# EAGLE board Precision Arduino Charlieplex (EAGLE 6.2), part 1 of 2
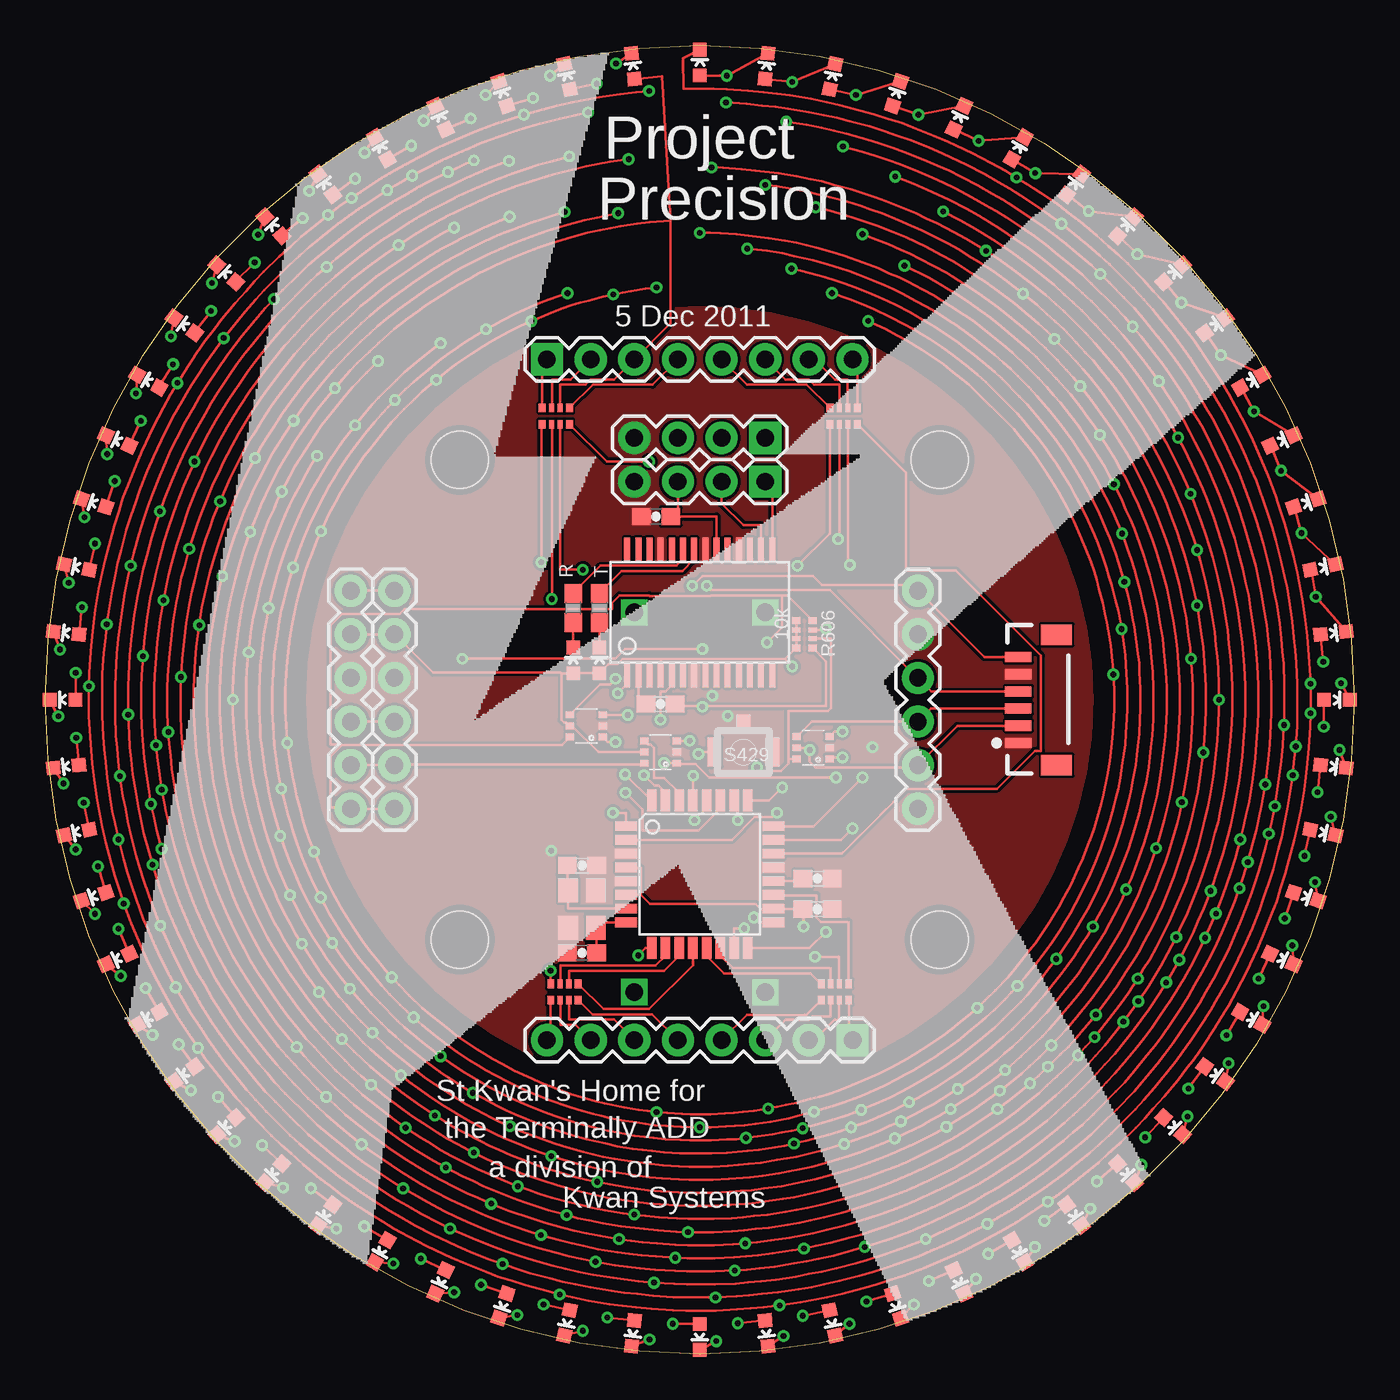
[diagram p2: board, top side]
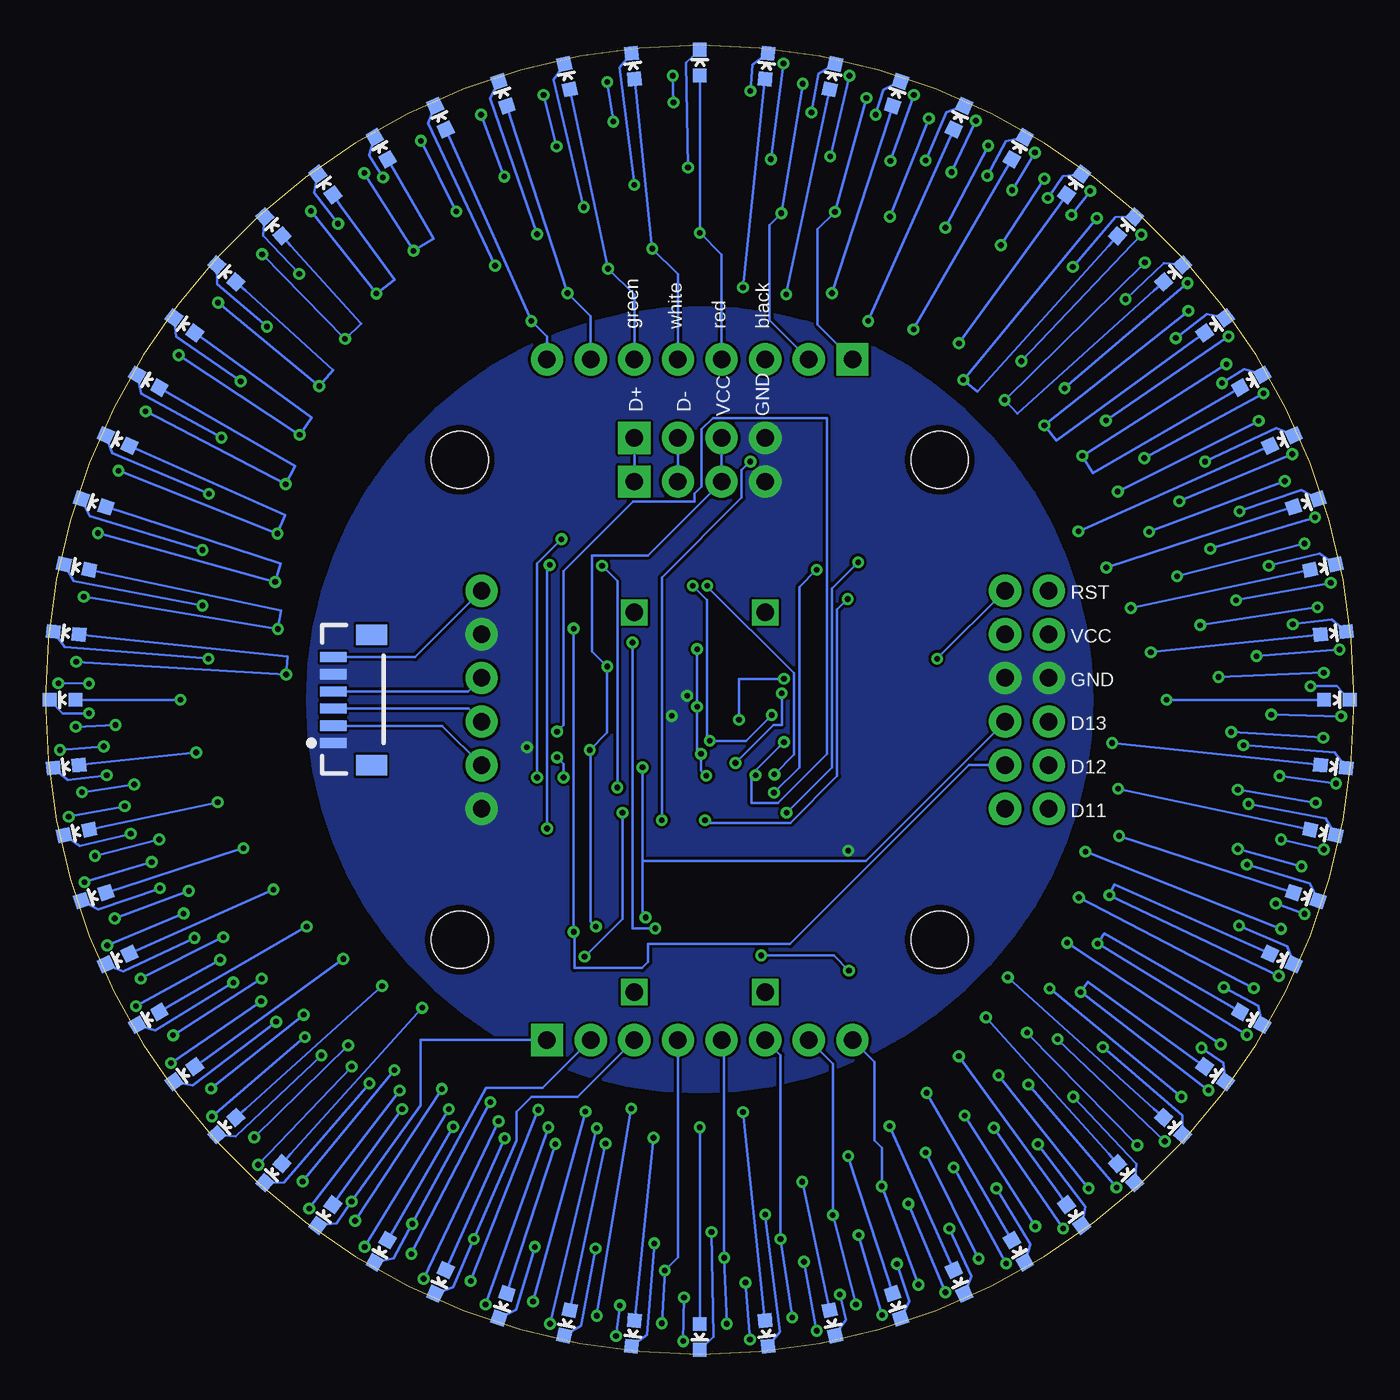
[diagram p3: board, bottom side, seen from below]

Size 76.2 x 76.2 mm. Coordinates in mm from the lower left corner, seen from the top.
Outline: 38.1,76.2 arc-90 76.2,38.1 arc-90 38.1,0 arc-90 0,38.1 arc-90 38.1,76.2
Copper layers (1*16): Top 0.0356mm / dielectric 1.5011mm / Bottom 0.0356mm
Design rules: minimum track width 6mil, minimum drill 13mil, track to track 6mil, track to pad 6mil, pad to pad 6mil, via to via 6mil, smd to smd 6mil, copper to edge 15mil, drill to drill 20mil, minimum pad ring 7mil, minimum via ring 7mil, stop-mask expansion 4mil, vias tented up to drill 14mil, thermal gap 10mil
Net classes: 0 default: width 0.152 mm, drill 0.33 mm, clearance 0.152 mm; 1 power: width 0.152 mm, drill 0.33 mm, clearance 0.152 mm

## Footprints (pad centres in the part's own frame; a part is rotated, then mirrored left to right if it is on the bottom)
0603-CAP = smd 1.1 x 1: 1 -0.85,0; 2 0.85,0
LED-0603 = smd 0.8 x 0.8: A 0,-0.75; C 0,0.75
1X04 = drill 1.016 pad 1.88 square: 1 0,0 | drill 1.016 pad 1.88: 2 2.54,0; 3 5.08,0; 4 7.62,0
1X06 = drill 1.016 pad 1.88: 1 0,0; 2 2.54,0; 3 5.08,0; 4 7.62,0; 5 10.16,0; 6 12.7,0
EM406 = smd 0.6 x 1.55: 1 0,0; 2 1,0; 3 2,0; 4 3,0; 5 4,0; 6 5,0 | smd 1.2 x 1.8: P$1 -1.3,-2.225; P$2 6.3,-2.225
1X08 = drill 1.016 pad 1.88 square: 1 0,0 | drill 1.016 pad 1.88: 2 2.54,0; 3 5.08,0; 4 7.62,0; 5 10.16,0; 6 12.7,0; 7 15.24,0; 8 17.78,0
STAND-OFF = hole 3.302: 0,0
CRA04 = smd 0.4 x 0.5: 1 -0.8,-0.475; 4 0.8,-0.475; 5 0.8,0.475; 8 -0.8,0.475 | smd 0.3 x 0.5: 2 -0.25,-0.475; 3 0.25,-0.475; 6 0.25,0.475; 7 -0.25,0.475
0603-RES = smd 1.1 x 1: 1 -0.85,0; 2 0.85,0
B3U-1100P = smd 0.8 x 1.7: P$1 -1.7,0; P$2 1.7,0 | smd 0.8 x 1.1: P$3 0,-1.65
TQFP32-08 = smd 1.27 x 0.559: 1 -4.293,2.8; 2 -4.293,2; 3 -4.293,1.2; 4 -4.293,0.4; 5 -4.293,-0.4; 6 -4.293,-1.2; 7 -4.293,-2; 8 -4.293,-2.8; 17 4.293,-2.8; 18 4.293,-2; 19 4.293,-1.2; 20 4.293,-0.4; 21 4.293,0.4; 22 4.293,1.2; 23 4.293,2; 24 4.293,2.8 | smd 0.559 x 1.27: 9 -2.8,-4.293; 10 -2,-4.293; 11 -1.2,-4.293; 12 -0.4,-4.293; 13 0.4,-4.293; 14 1.2,-4.293; 15 2,-4.293; 16 2.8,-4.293; 25 2.8,4.293; 26 2,4.293; 27 1.2,4.293; 28 0.4,4.293; 29 -0.4,4.293; 30 -1.2,4.293; 31 -2,4.293; 32 -2.8,4.293
SSOP28DB = smd 0.348 x 1.397: 1 -4.225,-3.656; 2 -3.575,-3.656; 3 -2.925,-3.656; 4 -2.275,-3.656; 5 -1.625,-3.656; 6 -0.975,-3.656; 7 -0.325,-3.656; 8 0.325,-3.656; 9 0.975,-3.656; 10 1.625,-3.656; 11 2.275,-3.656; 12 2.925,-3.656; 13 3.575,-3.656; 14 4.225,-3.656; 15 4.225,3.656; 16 3.575,3.656; 17 2.925,3.656; 18 2.275,3.656; 19 1.625,3.656; 20 0.975,3.656; 21 0.325,3.656; 22 -0.325,3.656; 23 -0.975,3.656; 24 -1.625,3.656; 25 -2.275,3.656; 26 -2.925,3.656; 27 -3.575,3.656; 28 -4.225,3.656
SC-70-6 = smd 0.4 x 0.5: 1 -0.65,-0.95; 2 0,-0.95; 3 0.65,-0.95; 4 0.65,0.95; 5 0,0.95; 6 -0.65,0.95
CRYSTAL_SMD = smd 1.4 x 1.15: 1 -1.092,-0.813; 2 1.092,-0.813; 3 1.092,0.813; 4 -1.092,0.813

## Placement (x,y rotation side)
C010  4.7uF  [0603-CAP]  35.56,48.77 180 top
C407  18pF  [0603-CAP]  31.24,28.45 180 top
C408  18pF  [0603-CAP]  31.24,23.37 0 top
C418  4.7uF  [0603-CAP]  44.96,25.91 180 top
C420  100nF  [0603-CAP]  44.96,27.69 0 top
C502  100nF  [0603-CAP]  35.81,37.85 180 top
D000  HOUR  [LED-0603]  38.1,75.18 0 top
D001  HOUR  [LED-0603]  41.99,74.98 354 top
D002  HOUR  [LED-0603]  45.82,74.37 348 top
D003  HOUR  [LED-0603]  49.56,73.38 342 top
D004  HOUR  [LED-0603]  53.19,71.98 336 top
D005  HOUR  [LED-0603]  56.64,70.21 330 top
D006  HOUR  [LED-0603]  59.89,68.1 324 top
D007  HOUR  [LED-0603]  62.92,65.66 318 top
D008  HOUR  [LED-0603]  65.66,62.92 312 top
D009  HOUR  [LED-0603]  68.1,59.89 306 top
D010  HOUR  [LED-0603]  70.21,56.64 300 top
D011  HOUR  [LED-0603]  71.98,53.19 294 top
D012  HOUR  [LED-0603]  73.38,49.56 288 top
D013  HOUR  [LED-0603]  74.37,45.82 282 top
D014  HOUR  [LED-0603]  74.98,41.99 276 top
D015  HOUR  [LED-0603]  75.18,38.1 270 top
D016  HOUR  [LED-0603]  74.98,34.21 264 top
D017  HOUR  [LED-0603]  74.37,30.38 258 top
D018  HOUR  [LED-0603]  73.38,26.64 252 top
D019  HOUR  [LED-0603]  71.98,23.01 246 top
D020  HOUR  [LED-0603]  70.21,19.56 240 top
D021  HOUR  [LED-0603]  68.1,16.31 234 top
D022  HOUR  [LED-0603]  65.66,13.28 228 top
D023  HOUR  [LED-0603]  62.92,10.54 222 top
D024  HOUR  [LED-0603]  59.89,8.1 216 top
D025  HOUR  [LED-0603]  56.64,5.99 210 top
D026  HOUR  [LED-0603]  53.19,4.22 204 top
D027  HOUR  [LED-0603]  49.56,2.82 198 top
D028  HOUR  [LED-0603]  45.82,1.83 192 top
D029  HOUR  [LED-0603]  41.99,1.22 186 top
D030  HOUR  [LED-0603]  38.1,1.02 180 top
D031  HOUR  [LED-0603]  34.21,1.22 174 top
D032  HOUR  [LED-0603]  30.38,1.83 168 top
D033  HOUR  [LED-0603]  26.64,2.82 162 top
D034  HOUR  [LED-0603]  23.01,4.22 156 top
D035  HOUR  [LED-0603]  19.56,5.99 150 top
D036  HOUR  [LED-0603]  16.31,8.1 144 top
D037  HOUR  [LED-0603]  13.28,10.54 138 top
D038  HOUR  [LED-0603]  10.54,13.28 132 top
D039  HOUR  [LED-0603]  8.1,16.31 126 top
D040  HOUR  [LED-0603]  5.99,19.56 120 top
D041  HOUR  [LED-0603]  4.22,23.01 114 top
D042  HOUR  [LED-0603]  2.82,26.64 108 top
D043  HOUR  [LED-0603]  1.83,30.38 102 top
D044  HOUR  [LED-0603]  1.22,34.21 96 top
D045  HOUR  [LED-0603]  1.02,38.1 90 top
D046  HOUR  [LED-0603]  1.22,41.99 84 top
D047  HOUR  [LED-0603]  1.83,45.82 78 top
D048  HOUR  [LED-0603]  2.82,49.56 72 top
D049  HOUR  [LED-0603]  4.22,53.19 66 top
D050  HOUR  [LED-0603]  5.99,56.64 60 top
D051  HOUR  [LED-0603]  8.1,59.89 54 top
D052  HOUR  [LED-0603]  10.54,62.92 48 top
D053  HOUR  [LED-0603]  13.28,65.66 42 top
D054  HOUR  [LED-0603]  16.31,68.1 36 top
D055  HOUR  [LED-0603]  19.56,70.21 30 top
D056  HOUR  [LED-0603]  23.01,71.98 24 top
D057  HOUR  [LED-0603]  26.64,73.38 18 top
D058  HOUR  [LED-0603]  30.38,74.37 12 top
D059  HOUR  [LED-0603]  34.21,74.98 6 top
D100  HOUR  [LED-0603]  38.1,75.18 0 bottom
D101  HOUR  [LED-0603]  41.99,74.98 6 bottom
D102  HOUR  [LED-0603]  45.82,74.37 12 bottom
D103  HOUR  [LED-0603]  49.56,73.38 18 bottom
D104  HOUR  [LED-0603]  53.19,71.98 24 bottom
D105  HOUR  [LED-0603]  56.64,70.21 30 bottom
D106  HOUR  [LED-0603]  59.89,68.1 36 bottom
D107  HOUR  [LED-0603]  62.92,65.66 42 bottom
D108  HOUR  [LED-0603]  65.66,62.92 48 bottom
D109  HOUR  [LED-0603]  68.1,59.89 54 bottom
D110  HOUR  [LED-0603]  70.21,56.64 60 bottom
D111  HOUR  [LED-0603]  71.98,53.19 66 bottom
D112  HOUR  [LED-0603]  73.38,49.56 72 bottom
D113  HOUR  [LED-0603]  74.37,45.82 78 bottom
D114  HOUR  [LED-0603]  74.98,41.99 84 bottom
D115  HOUR  [LED-0603]  75.18,38.1 90 bottom
D116  HOUR  [LED-0603]  74.98,34.21 96 bottom
D117  HOUR  [LED-0603]  74.37,30.38 102 bottom
D118  HOUR  [LED-0603]  73.38,26.64 108 bottom
D119  HOUR  [LED-0603]  71.98,23.01 114 bottom
D120  HOUR  [LED-0603]  70.21,19.56 120 bottom
D121  HOUR  [LED-0603]  68.1,16.31 126 bottom
D122  HOUR  [LED-0603]  65.66,13.28 132 bottom
D123  HOUR  [LED-0603]  62.92,10.54 138 bottom
D124  HOUR  [LED-0603]  59.89,8.1 144 bottom
D125  HOUR  [LED-0603]  56.64,5.99 150 bottom
D126  HOUR  [LED-0603]  53.19,4.22 156 bottom
D127  HOUR  [LED-0603]  49.56,2.82 162 bottom
D128  HOUR  [LED-0603]  45.82,1.83 168 bottom
D129  HOUR  [LED-0603]  41.99,1.22 174 bottom
D130  HOUR  [LED-0603]  38.1,1.02 180 bottom
D131  HOUR  [LED-0603]  34.21,1.22 186 bottom
D132  HOUR  [LED-0603]  30.38,1.83 192 bottom
D133  HOUR  [LED-0603]  26.64,2.82 198 bottom
D134  HOUR  [LED-0603]  23.01,4.22 204 bottom
D135  HOUR  [LED-0603]  19.56,5.99 210 bottom
D136  HOUR  [LED-0603]  16.31,8.1 216 bottom
D137  HOUR  [LED-0603]  13.28,10.54 222 bottom
D138  HOUR  [LED-0603]  10.54,13.28 228 bottom
D139  HOUR  [LED-0603]  8.1,16.31 234 bottom
D140  HOUR  [LED-0603]  5.99,19.56 240 bottom
D141  HOUR  [LED-0603]  4.22,23.01 246 bottom
D142  HOUR  [LED-0603]  2.82,26.64 252 bottom
D143  HOUR  [LED-0603]  1.83,30.38 258 bottom
D144  HOUR  [LED-0603]  1.22,34.21 264 bottom
D145  HOUR  [LED-0603]  1.02,38.1 270 bottom
D146  HOUR  [LED-0603]  1.22,41.99 276 bottom
D147  HOUR  [LED-0603]  1.83,45.82 282 bottom
D148  HOUR  [LED-0603]  2.82,49.56 288 bottom
D149  HOUR  [LED-0603]  4.22,53.19 294 bottom
D150  HOUR  [LED-0603]  5.99,56.64 300 bottom
D151  HOUR  [LED-0603]  8.1,59.89 306 bottom
D152  HOUR  [LED-0603]  10.54,62.92 312 bottom
D153  HOUR  [LED-0603]  13.28,65.66 318 bottom
D154  HOUR  [LED-0603]  16.31,68.1 324 bottom
D155  HOUR  [LED-0603]  19.56,70.21 330 bottom
D156  HOUR  [LED-0603]  23.01,71.98 336 bottom
D157  HOUR  [LED-0603]  26.64,73.38 342 bottom
D158  HOUR  [LED-0603]  30.38,74.37 348 bottom
D159  HOUR  [LED-0603]  34.21,74.98 354 bottom
D501  RED  [LED-0603]  30.73,40.39 0 top
D502  BLUE  [LED-0603]  32.26,40.39 0 top
J001  [1X04]  41.91,50.8 180 top
J002  [1X04]  41.91,53.34 180 top
J003  [1X06]  20.32,44.45 270 top
J005  [1X06]  17.78,44.45 270 top
J402  EM406  [EM406]  59.44,35.59 90 bottom
J403  [1X06]  50.8,31.75 90 top
J404  EM406  [EM406]  56.64,35.59 90 top
J405  [1X08]  29.21,57.91 0 top
J406  [1X08]  46.99,18.29 180 top
JP1  STAND-OFF  [STAND-OFF]  24.13,24.13 0 top
JP2  STAND-OFF  [STAND-OFF]  52.07,24.13 0 top
JP3  STAND-OFF  [STAND-OFF]  52.07,52.07 0 top
JP4  STAND-OFF  [STAND-OFF]  24.13,52.07 0 top
R1  47  [CRA04]  45.97,21.08 180 top
R2  47  [CRA04]  30.23,21.08 180 top
R3  47  [CRA04]  29.72,54.61 0 top
R4  47  [CRA04]  46.48,54.61 0 top
R501  680  [0603-RES]  30.73,43.43 270 top
R502  680  [0603-RES]  32.26,43.43 270 top
R606  10k  [CRA04]  44.2,41.91 270 top
S429  B3U-1100P  [B3U-1100P]  40.64,35.05 180 top
U401  ATMEGA328  [TQFP32-08]  38.1,27.94 0 top
U501  FT232RLSSOP  [SSOP28DB]  38.1,43.18 0 top
U601  ZF7  [SC-70-6]  31.5,36.58 90 top
U602  ZF7  [SC-70-6]  35.81,35.05 90 top
U603  ZF7  [SC-70-6]  44.7,35.31 90 top
Y401  12.00  [CRYSTAL_SMD]  31.24,25.91 270 top

## Tracks (layer width: path | path; a pad name or v marks a point on that pad's centre or on a via)
AREF
  Top 0.152: C420.1 44.09,27.69 43.97,27.56 42.39,27.56 U401.20
AT_RX
  Top 0.152: U602.4 34.87,35.69 35.08,35.48 35.23,35.48 35.43,35.28 35.43,33.55 36.02,33.55 36.88,32.69 36.88,32.23 U401.30
AT_TX  (via drill 0.33)
  Top 0.152: v33.2,35.64 32.74,35.64 32.46,35.92 U601.1 | v34.85,33.71 35.46,33.1 35.69,33.1 36.09,32.69 U401.31 | v46.41,36.25 45.95,36.25 45.67,35.97 U603.3
  Bottom 0.152: v33.2,35.64 34.85,33.98 v34.85,33.71 35.1,33.45 35.1,32.11 33.55,32.11 30.71,34.95 30.71,54.51 37.34,54.51 38,53.85 38,50.49 38.41,50.09 38.41,49.63 41.99,49.63 46.02,45.59 46.02,36.63 v46.41,36.25
D11  (via drill 0.33)
  Top 0.152: J003.6 J005.6 17.73,31.83 16.61,31.83 16.61,34.8 17.27,35.46 | 17.27,35.46 30.07,35.46 30.53,35.92 U601.6 | 42.9,44.17 38.76,44.17 38.73,44.15 35.18,44.15 35.15,44.17 33.43,44.17 32.99,43.74 32.99,43.38 20.93,43.38 20.62,43.08 17.27,43.08 16.61,42.42 16.61,35.51 17.22,35.51 17.27,35.46 | 42.9,44.17 43.2,44.17 44.65,42.72 R606.8 | v40.69,24.79 40.11,24.79 U401.15 | v42.01,41.43 42.9,42.32 42.9,44.17
  Bottom 0.152: v40.69,24.79 42.01,24.79 v42.01,41.43
D12  (via drill 0.33)
  Top 0.152: J005.5 J003.5 20.4,34.34 34.8,34.34 34.85,34.39 U602.6 | v45.44,24.59 44.5,23.65 U401.16 | R606.7 45.36,42.16 v45.44,42.24
  Bottom 0.152: v45.44,42.24 v45.44,24.59 45.39,24.54 45.39,22.48 41.45,22.48 41.1,22.84 41.1,23.88 32.84,23.88 22.43,34.29 J003.5
D13  (via drill 0.33)
  Top 0.152: J005.4 J003.4 | R606.6 45.74,41.66 45.74,37.62 45.57,37.44 43.26,37.44 43.26,34.66 | v41.43,34.16 41.63,33.96 42.82,33.96 43.26,34.39 43.26,34.66 | U401.17 41.53,25.14 v41.25,25.43 | 43.26,34.66 U603.6
  Bottom 0.152: v41.25,25.43 41.43,25.6 41.43,28.73 | 41.43,28.73 v41.43,34.16 | J003.4 28.42,28.73 41.43,28.73
GND  (via drill 0.33)
  other vias: 38.84,38.33 39.73,37.16 48.16,35.33 29.46,29.31
  pour Bottom (no thermals): 15.24,38.1 arc-90 38.1,60.96 arc-90 60.96,38.1 arc-90 38.1,15.24 arc-90
  pour Top (no thermals): 15.24,38.1 arc-90 38.1,60.96 arc-90 60.96,38.1 arc-90 38.1,15.24 arc-90
GPS_RX
  Top 0.152: J404.3 51.55,37.59 J403.3 44.63,36.83 43.76,35.97 U603.4
  Bottom 0.152: J403.3 51.55,37.59 J402.3
GPS_TX  (via drill 0.33)
  Top 0.152: J404.4 51.59,38.59 J403.4 50.72,39.42 45.67,44.48 38.76,44.48 v38.51,44.73 | v33.91,37.21 32.46,37.21 U601.3 | v37.52,35.71 36.78,35.71 U602.3
  Bottom 0.152: J403.4 51.59,38.59 J402.4 | v33.91,37.21 35.41,35.71 v37.52,35.71 37.67,35.87 37.67,43.89 v38.51,44.73
N$1  (via drill 1.02)
  other vias: 34.29,43.18
N$2  (via drill 1.02)
  other vias: 41.91,43.18
N$3
  Top 0.152: C502.2 34.52,38.28 U501.2
N$5
  Top 0.152: R501.2 D501.C
N$6
  Top 0.152: R501.1 30.73,44.3 32.33,45.9 36.75,45.9 37.11,46.25 37.11,46.81 U501.23
N$7
  Top 0.152: R502.1 32.26,44.3 33.55,45.59 37.08,45.59 37.77,46.28 37.77,46.81 U501.22
N$8
  Top 0.152: D502.C R502.2
N$106  (via drill 1.02)
  other vias: 34.29,21.08
N$907  (via drill 1.02)
  other vias: 41.91,21.08
P01
  Top 0.152: R1.1 46.76,25.17 45.16,25.17 44.91,25.43 44.91,26.72 42.39,26.72 U401.19
P02  (via drill 0.33)
  Top 0.152: v44.81,23.14 46.2,23.14 46.2,21.57 R1.2 | v42.6,31.52 42.34,31.27 41.3,31.27 39.98,29.95 U401.2
  Bottom 0.152: v44.81,23.14 42.6,25.35 v42.6,31.52
P03
  Top 0.152: R1.3 45.72,22.48 40.03,22.48 39.32,23.19 39.32,23.65 U401.14
P04
  Top 0.152: R1.4 44.55,22.17 39.52,22.17 38.51,23.19 U401.13
P05
  Top 0.152: R2.1 31.04,21.54 32.49,20.09 35.15,20.09 37.69,22.63 U401.12
P06
  Top 0.152: R2.2 30.48,22.33 36.02,22.33 36.88,23.19 36.88,23.65 U401.11
P07
  Top 0.152: R2.3 30,21.57 30,22.63 35.53,22.63 36.09,23.19 U401.10
P08  (via drill 0.33)
  Top 0.152: v29.41,22.33 29.41,21.57 R2.4 | v34.52,23.22 34.95,23.65 U401.9
  Bottom 0.152: v29.41,22.33 30.3,23.22 v34.52,23.22
P09  (via drill 0.33)
  Top 0.152: v28.88,46.1 28.91,46.1 28.91,54.13 R3.1 | U401.1 33.81,31.52 v33.05,31.52
  Bottom 0.152: v28.88,46.1 30.4,44.58 30.4,34.16 v33.05,31.52
P10  (via drill 0.33)
  Top 0.152: v29.49,43.97 29.49,54.13 R3.2 | v37.8,31.09 38.48,31.77 38.48,32.23 U401.28
  Bottom 0.152: v29.49,43.97 30.1,43.36 30.1,33.66 32.82,30.94 37.8,30.94 v37.8,31.09
P11  (via drill 0.33)
  Top 0.152: v31.29,45.67 29.97,45.67 R3.3 | v33.78,32.69 34.77,31.7 34.77,30.5 38.02,30.5 39.29,31.77 U401.27
  Bottom 0.152: v31.29,45.67 32.31,44.65 32.31,34.16 v33.78,32.69
P12  (via drill 0.33)
  Top 0.152: v35.15,51.97 32.69,51.97 R3.4 | v40.31,31.09 40.31,32.23 U401.26
  Bottom 0.152: v35.15,51.97 35.66,51.46 35.66,49.86 40.31,45.21 v40.31,31.09
P13  (via drill 0.33)
  Top 0.152: v43.79,45.9 45.67,47.78 45.67,54.13 R4.1 | v42.9,32.99 42.14,32.23 U401.25
  Bottom 0.152: v43.79,45.9 42.9,45.01 v42.9,32.99
P14  (via drill 0.33)
  Top 0.152: v46.15,47.45 46.23,47.45 R4.2 | v47.57,33.58 44.73,30.73 U401.24
  Bottom 0.152: v46.15,47.45 47.57,46.02 v47.57,33.58
P15  (via drill 0.33)
  Top 0.152: v46.84,45.95 46.74,45.95 R4.3 | v46.99,30.61 46.33,29.95 U401.23
  Bottom 0.152: v46.84,45.95 46.99,45.8 v46.99,30.61
P16
  Top 0.152: R4.4 47.3,54.13 50.09,51.33 50.09,45.62 53.01,45.62 57.96,40.66 57.96,35.13 57.61,35.13 55.4,32.92 50.14,32.92 46.38,29.16 42.39,29.16 U401.22
PPS  (via drill 0.33)
  Top 0.152: J404.6 54.66,40.59 J403.6 50.72,44.5 50.44,44.78 45.21,44.78 44.68,45.31 38.25,45.31 v37.67,44.73 | v33.76,33.76 35.28,32.23 U401.32
  Bottom 0.152: J403.6 54.66,40.59 J402.6 | v33.76,33.76 32.61,34.9 32.61,39.65 37.67,44.7 v37.67,44.73
Q01  (via drill 0.33)
  Top 0.152: v35.15,73.53 34.39,73.46 33.45,73.36 32.23,73.18 30.71,72.87 29.79,72.67 28.6,72.36 v27.86,72.16 27.1,71.91 26.24,71.63 25.07,71.2 23.65,70.59 22.78,70.21 21.69,69.65 20.32,68.89 19.53,68.43 18.47,67.74 v17.83,67.31 17.2,66.88 v16.46,66.32 15.47,65.53 14.88,65.05 14.3,64.52 13.61,63.91 12.72,63.02 12.19,62.46 11.68,61.9 11.05,61.19 10.26,60.25 9.8,59.61 9.32,59 8.79,58.24 8.1,57.2 v7.7,56.54 7.32,55.88 6.86,55.07 6.27,53.98 5.61,52.55 5.26,51.71 4.8,50.55 4.52,49.84 4.29,49.1 4.01,48.21 3.68,47.02 3.48,46.25 3.33,45.49 3.12,44.58 2.92,43.36 2.82,42.6 2.74,41.81 2.64,40.89 2.56,39.65 v2.54,38.89 2.54,37.16 2.62,35.94 2.67,35.15 2.74,34.39 2.85,33.45 3.02,32.23 3.33,30.71 3.53,29.79 3.83,28.6 4.04,27.86 4.29,27.1 v4.57,26.24 5,25.07 5.61,23.65 5.99,22.78 6.55,21.69 7.32,20.32 7.77,19.53 8.46,18.47 v8.89,17.83 9.32,17.2 9.88,16.46 10.67,15.47 11.15,14.88 11.68,14.3 12.29,13.61 13.18,12.72 13.74,12.19 14.3,11.68 15.01,11.05 15.95,10.26 16.59,9.8 17.2,9.32 17.96,8.79 19,8.1 19.66,7.7 20.32,7.32 21.13,6.86 22.23,6.27 23.65,5.61 24.49,5.26 25.65,4.8 26.36,4.52 27.1,4.29 27.99,4.01 29.18,3.68 v29.95,3.48 30.71,3.33 31.62,3.12 32.84,2.92 33.6,2.82 34.39,2.74 35.31,2.64 36.55,2.56 37.31,2.54 39.04,2.54 40.26,2.62 41.05,2.67 41.81,2.74 v42.75,2.85 43.97,3.02 45.49,3.33 46.41,3.53 47.6,3.83 48.34,4.04 49.1,4.29 49.96,4.57 51.13,5 52.55,5.61 53.42,5.99 54.51,6.55 55.88,7.32 56.67,7.77 57.73,8.46 v58.37,8.89 59,9.32 59.74,9.88 60.73,10.67 61.32,11.15 61.9,11.68 62.59,12.29 63.48,13.18 64.01,13.74 64.52,14.3 65.15,15.01 65.94,15.95 66.4,16.59 66.88,17.2 67.41,17.96 68.1,19 68.5,19.66 68.89,20.32 69.34,21.13 69.93,22.23 70.59,23.65 70.94,24.49 71.4,25.65 71.68,26.36 71.91,27.1 72.19,27.99 72.52,29.18 72.72,29.95 72.87,30.71 73.08,31.62 73.28,32.84 73.38,33.6 73.46,34.39 73.56,35.31 73.64,36.55 v73.66,37.31 v73.66,39.04 73.58,40.26 73.53,41.05 73.46,41.81 73.36,42.75 73.18,43.97 72.87,45.49 72.67,46.41 72.36,47.6 72.16,48.34 71.91,49.1 71.63,49.96 71.2,51.13 70.59,52.55 70.21,53.42 69.65,54.51 68.89,55.88 68.43,56.67 67.74,57.73 66.88,59 66.32,59.74 65.53,60.73 65.05,61.32 64.52,61.9 63.91,62.59 63.02,63.48 62.46,64.01 61.9,64.52 61.19,65.15 60.25,65.94 59.61,66.4 59,66.88 58.24,67.41 57.2,68.1 v56.54,68.5 55.88,68.89 55.07,69.34 53.98,69.93 52.55,70.59 51.71,70.94 50.55,71.4 49.84,71.68 49.1,71.91 48.21,72.19 47.02,72.52 46.25,72.72 45.49,72.87 44.58,73.08 43.36,73.28 42.6,73.38 41.81,73.46 40.89,73.56 39.65,73.64 38.89,73.66 37.16,73.66 37.13,75.44 D000.C
  Top 0.152: v42.98,1.07 D029.C | v2.9,25.63 D042.C | v15.37,67.72 15.89,68.66 D154.C | v75.44,39.06 D115.C | J406.1 46.79,18.29 46.79,20.6 R1.8
  Bottom 0.152: v73.66,39.04 v75.44,39.06 | v42.75,2.85 v42.98,1.07 | v4.57,26.24 v2.9,25.63 | v16.46,66.32 v15.37,67.72 | v56.54,68.5 57.35,69.8 D105.C | v73.66,37.31 75.18,37.29 D115.C | v29.95,3.48 29.59,2.01 D132.C | v8.89,17.83 7.62,16.97 D139.C | v2.54,38.89 1.02,38.91 D145.C | v7.7,56.54 6.4,57.35 D150.C | v17.83,67.31 16.97,68.58 D154.C | v27.86,72.16 27.41,73.61 D157.C | v35.15,73.53 35.03,75.06 D159.C | D124.C 59.23,7.62 v58.37,8.89 54.36,14.48 54.36,18.29 J406.1
Q02  (via drill 0.33)
  Top 0.152: v39.62,72.87 40.82,72.8 41.73,72.69 42.49,72.62 43.23,72.52 44.45,72.31 45.34,72.14 46.08,71.98 46.81,71.78 47.98,71.48 48.84,71.2 49.58,70.94 50.29,70.69 51.41,70.26 52.25,69.9 53.62,69.24 54.71,68.68 55.5,68.22 56.16,67.84 56.79,67.44 57.81,66.78 58.55,66.24 v59.16,65.81 59.77,65.33 60.71,64.57 61.39,63.96 61.95,63.45 63.35,62.05 63.96,61.39 64.47,60.81 64.95,60.22 65.71,59.28 66.24,58.55 66.7,57.94 67.11,57.3 67.77,56.29 68.22,55.5 68.61,54.84 68.96,54.18 69.52,53.09 69.9,52.25 70.18,51.56 70.48,50.85 70.89,49.71 71.2,48.84 71.42,48.13 71.63,47.4 71.93,46.23 72.14,45.34 72.29,44.6 72.42,43.84 72.59,42.65 72.69,41.73 72.77,40.97 72.82,40.23 72.9,39.01 72.9,37.34 72.87,36.58 v72.8,35.38 72.69,34.47 v72.62,33.71 72.52,32.97 72.31,31.75 72.14,30.86 71.98,30.12 71.78,29.39 71.48,28.22 71.2,27.36 70.94,26.62 70.69,25.91 70.26,24.79 69.9,23.95 69.24,22.58 68.68,21.49 68.22,20.7 67.84,20.04 67.44,19.41 66.78,18.39 66.24,17.65 65.81,17.04 65.33,16.43 64.57,15.49 63.96,14.81 63.45,14.25 62.05,12.85 61.39,12.24 60.81,11.73 60.22,11.25 59.28,10.49 58.55,9.96 57.94,9.5 57.3,9.09 56.29,8.43 55.5,7.98 v54.84,7.59 54.18,7.24 53.09,6.68 52.25,6.3 51.56,6.02 50.85,5.71 49.71,5.31 48.84,5 48.13,4.78 47.4,4.57 46.23,4.27 45.34,4.06 44.6,3.91 43.84,3.79 42.65,3.61 41.73,3.5 40.97,3.43 40.23,3.38 v39.01,3.3 37.34,3.3 36.58,3.33 35.38,3.4 34.47,3.5 33.71,3.58 32.97,3.68 31.75,3.89 30.86,4.06 30.12,4.22 29.39,4.42 28.22,4.72 27.36,5 v26.62,5.26 25.91,5.51 24.79,5.94 23.95,6.3 22.58,6.96 21.49,7.52 20.7,7.98 20.04,8.36 19.41,8.76 18.39,9.42 17.65,9.96 17.04,10.39 16.43,10.87 15.49,11.63 14.81,12.24 14.25,12.75 12.85,14.15 12.24,14.81 11.73,15.39 11.25,15.98 10.49,16.92 9.96,17.65 9.5,18.26 9.09,18.9 8.43,19.91 7.98,20.7 v7.59,21.36 7.24,22.02 6.68,23.11 6.3,23.95 6.02,24.64 5.71,25.35 5.31,26.49 5,27.36 4.78,28.07 4.57,28.8 v4.27,29.97 4.06,30.86 3.91,31.6 3.79,32.36 3.61,33.55 3.5,34.47 3.43,35.23 3.38,35.97 3.3,37.19 3.3,38.86 3.33,39.62 3.4,40.82 3.5,41.73 v3.58,42.49 3.68,43.23 3.89,44.45 4.06,45.34 4.22,46.08 4.42,46.81 4.72,47.98 5,48.84 5.26,49.58 5.51,50.29 5.94,51.41 6.3,52.25 6.96,53.62 7.52,54.71 7.98,55.5 8.36,56.16 8.76,56.79 9.42,57.81 9.96,58.55 v10.39,59.16 10.87,59.77 11.63,60.71 12.24,61.39 12.75,61.95 14.15,63.35 14.81,63.96 15.39,64.47 15.98,64.95 16.92,65.71 17.65,66.24 18.26,66.7 18.9,67.11 v19.91,67.77 20.7,68.22 v21.36,68.61 22.02,68.96 23.11,69.52 23.95,69.9 24.64,70.18 25.35,70.48 26.49,70.89 27.36,71.2 28.07,71.42 28.8,71.63 29.97,71.93 30.86,72.14 v31.6,72.29
  Top 0.152: D000.A v39.67,74.42 D001.C | v39.06,0.76 D030.C | v1.78,29.39 D043.C | v18.59,69.95 D055.C | v75.34,35.18 D016.C | J406.2 44.78,18.29 45.95,19.46 46.2,19.46 46.2,20.6 R1.7
  Bottom 0.152: v39.62,72.87 v39.67,74.42 | v72.8,35.38 v75.34,35.18 | v39.01,3.3 v39.06,0.76 | v4.27,29.97 v1.78,29.39 | v19.91,67.77 v18.59,69.95 | v59.16,65.81 60.55,67.61 D106.C | v72.62,33.71 74.91,33.43 D016.C 75.68,34.14 | v26.62,5.26 25.88,3.07 D133.C | v7.59,21.36 5.59,20.27 D140.C | v3.58,42.49 1.29,42.77 D146.C | v10.39,59.16 8.59,60.55 D151.C | v21.36,68.61 20.27,70.61 D055.C | v31.6,72.29 31.19,74.55 D158.C | D125.C 55.93,5.59 v54.84,7.59 50.55,15.49 47.24,15.49 J406.2
Q03  (via drill 0.33)
  Top 0.152: v43.13,71.75 44.3,71.58 45.19,71.4 45.9,71.22 46.63,71.04 47.78,70.74 48.62,70.46 49.33,70.23 50.01,69.98 51.13,69.55 51.94,69.19 52.63,68.89 53.29,68.56 54.33,68.02 55.12,67.56 55.75,67.21 56.39,66.8 57.38,66.14 58.12,65.63 58.7,65.2 59.28,64.75 60.2,63.98 60.88,63.4 v61.42,62.89 61.95,62.38 62.79,61.52 63.4,60.88 63.88,60.33 64.36,59.74 65.1,58.83 65.63,58.12 66.06,57.51 66.47,56.9 67.13,55.88 67.56,55.12 67.94,54.48 68.3,53.82 68.81,52.76 69.19,51.94 69.49,51.26 69.77,50.57 70.18,49.45 70.46,48.62 70.69,47.9 70.89,47.19 71.2,46.05 71.4,45.19 71.53,44.45 71.68,43.71 71.86,42.55 71.96,41.66 72.01,40.92 72.08,40.18 72.14,38.99 72.14,37.36 v72.11,36.63 72.03,35.43 71.96,34.54 71.75,33.07 v71.58,31.9 71.4,31.01 v71.22,30.3 71.04,29.57 70.74,28.42 70.46,27.58 70.23,26.87 69.98,26.19 69.55,25.07 69.19,24.26 68.89,23.57 68.56,22.91 68.02,21.87 67.56,21.08 67.21,20.45 66.8,19.81 66.14,18.82 65.63,18.09 65.2,17.5 64.75,16.92 63.98,16 63.4,15.32 62.38,14.25 61.52,13.41 60.88,12.8 60.33,12.32 59.74,11.84 58.83,11.1 58.12,10.57 57.51,10.13 56.9,9.73 55.88,9.07 55.12,8.64 54.48,8.26 53.82,7.9 52.76,7.39 51.94,7.01 v51.26,6.71 50.57,6.43 49.45,6.02 48.62,5.74 47.9,5.51 47.19,5.31 46.05,5 45.19,4.8 44.45,4.67 43.71,4.52 42.55,4.34 41.66,4.24 40.92,4.19 40.18,4.12 38.99,4.06 37.36,4.06 36.63,4.09 v35.43,4.17 34.54,4.24 33.07,4.45 31.9,4.62 31.01,4.8 30.3,4.98 29.57,5.16 28.42,5.46 27.58,5.74 26.87,5.97 26.19,6.22 25.07,6.66 24.26,7.01 v23.57,7.32 22.91,7.64 21.87,8.18 21.08,8.64 20.45,8.99 19.81,9.4 18.82,10.06 18.09,10.57 17.5,11 16.92,11.46 16,12.22 15.32,12.8 14.25,13.82 13.41,14.68 12.8,15.32 12.32,15.88 11.84,16.46 11.1,17.37 10.57,18.09 10.13,18.69 9.73,19.3 9.07,20.32 8.64,21.08 8.26,21.72 7.9,22.38 7.39,23.44 7.01,24.26 v6.71,24.94 6.43,25.63 6.02,26.75 5.74,27.58 5.51,28.3 5.31,29.01 5,30.15 4.8,31.01 4.67,31.75 4.52,32.49 v4.34,33.66 4.24,34.54 4.19,35.28 4.12,36.02 4.06,37.21 4.06,38.84 4.09,39.57 4.17,40.77 4.24,41.66 4.45,43.13 4.62,44.3 4.8,45.19 v4.98,45.9 5.16,46.63 5.46,47.78 5.74,48.62 5.97,49.33 6.22,50.01 6.66,51.13 7.01,51.94 7.32,52.63 7.64,53.29 8.18,54.33 8.64,55.12 8.99,55.75 9.4,56.39 10.06,57.38 10.57,58.12 11,58.7 11.46,59.28 12.22,60.2 12.8,60.88 v13.31,61.42 13.82,61.95 14.68,62.79 15.32,63.4 15.88,63.88 16.46,64.36 17.37,65.1 18.09,65.63 18.69,66.06 19.3,66.47 20.32,67.13 21.08,67.56 21.72,67.94 22.38,68.3 v23.44,68.81 24.26,69.19 v24.94,69.49
  Top 0.152: D001.A v43.48,74.07 D002.C | v74.42,36.52 D015.A | v35.18,0.86 D031.C | v1.07,33.22 D044.C | v22.02,71.81 22.73,72.62 D056.C | v74.83,31.29 D017.C | J406.3 43.08,19.46 44.45,19.46 44.65,19.66 45.72,19.66 R1.6
  Bottom 0.152: v43.13,71.75 v43.48,74.07 | v72.11,36.63 v74.42,36.52 | v71.58,31.9 v74.83,31.29 | v35.43,4.17 v35.18,0.86 | v4.34,33.66 v1.07,33.22 | v23.44,68.81 v22.02,71.81 | v61.42,62.89 63.52,65.13 D107.C | v71.22,30.3 74.19,29.59 D017.C | v23.57,7.32 22.28,4.55 D134.C | v6.71,24.94 3.89,23.75 D141.C | v4.98,45.9 2.01,46.61 D147.C | v13.31,61.42 11.07,63.52 D152.C | v24.94,69.49 23.75,72.31 D056.C | D126.C 52.45,3.89 v51.26,6.71 48.77,12.45 48.77,14.1 47.88,14.99 45.21,14.99 J406.3
Q04  (via drill 0.33)
  Top 0.152: v46.43,70.31 47.55,70 48.39,69.75 49.07,69.52 49.76,69.27 50.83,68.83 51.64,68.5 52.3,68.2 52.96,67.87 53.98,67.33 54.74,66.9 55.37,66.55 55.98,66.17 56.95,65.53 57.66,65.02 58.24,64.59 58.8,64.14 59.72,63.4 60.38,62.84 60.91,62.33 62.23,61.01 62.84,60.38 v63.3,59.82 63.78,59.26 65.02,57.66 65.43,57.07 65.84,56.46 66.47,55.47 66.9,54.74 67.28,54.1 67.61,53.47 68.12,52.43 68.5,51.64 68.78,50.98 69.06,50.29 69.47,49.2 69.75,48.39 69.95,47.7 70.16,46.99 70.46,45.87 70.64,45.01 70.79,44.3 70.92,43.59 71.09,42.44 71.2,41.58 71.27,40.84 71.32,40.13 71.37,38.96 71.37,37.36 71.35,36.65 71.27,35.48 71.2,34.62 71.12,33.91 v71.02,33.17 70.81,32.03 70.64,31.19 70.48,30.48 70.31,29.77 v70,28.65 69.75,27.81 v69.52,27.13 69.27,26.44 68.83,25.38 68.5,24.56 68.2,23.9 67.87,23.24 67.33,22.23 66.9,21.46 66.55,20.83 66.17,20.22 65.53,19.25 65.02,18.54 64.59,17.96 64.14,17.4 63.4,16.48 62.84,15.82 62.33,15.29 61.01,13.97 60.38,13.36 59.82,12.9 59.26,12.42 57.66,11.18 57.07,10.77 56.46,10.36 55.47,9.73 54.74,9.3 54.1,8.91 53.47,8.59 52.43,8.08 51.64,7.7 50.98,7.42 50.29,7.14 49.2,6.73 48.39,6.45 v47.7,6.25 46.99,6.04 45.87,5.74 45.01,5.56 44.3,5.41 43.59,5.28 42.44,5.11 41.58,5 40.84,4.93 v40.13,4.88 38.96,4.83 37.36,4.83 36.65,4.85 35.48,4.93 34.62,5 33.91,5.08 33.17,5.18 v32.03,5.38 31.19,5.56 30.48,5.71 29.77,5.89 28.65,6.2 27.81,6.45 27.13,6.68 26.44,6.93 25.38,7.37 24.56,7.7 23.9,8 23.24,8.33 22.23,8.87 21.46,9.3 v20.83,9.65 20.22,10.03 19.25,10.67 18.54,11.18 17.96,11.61 17.4,12.06 16.48,12.8 15.82,13.36 15.29,13.87 13.97,15.19 13.36,15.82 12.9,16.38 12.42,16.94 11.18,18.54 10.77,19.13 10.36,19.74 9.73,20.73 9.3,21.46 8.91,22.1 8.59,22.73 8.08,23.77 7.7,24.56 7.42,25.22 7.14,25.91 6.73,27 6.45,27.81 v6.25,28.5 6.04,29.21 5.74,30.33 5.56,31.19 5.41,31.9 5.28,32.61 5.11,33.76 5,34.62 4.93,35.36 4.88,36.07 v4.83,37.24 4.83,38.84 4.85,39.55 4.93,40.72 5,41.58 5.08,42.29 5.18,43.03 5.38,44.17 5.56,45.01 5.71,45.72 5.89,46.43 6.2,47.55 6.45,48.39 v6.68,49.07 6.93,49.76 7.37,50.83 7.7,51.64 8,52.3 8.33,52.96 8.87,53.98 9.3,54.74 9.65,55.37 10.03,55.98 10.67,56.95 11.18,57.66 11.61,58.24 12.06,58.8 12.8,59.72 13.36,60.38 13.87,60.91 15.19,62.23 15.82,62.84 v16.38,63.3 16.94,63.78 18.54,65.02 19.13,65.43 19.74,65.84 20.73,66.47 21.46,66.9 22.1,67.28 22.73,67.61 23.77,68.12 24.56,68.5 25.22,68.78 25.91,69.06 v27,69.47
  Top 0.152: v40.31,1.8 D029.A | v31.29,1.37 D032.C | v0.76,37.13 D045.C | v25.63,73.3 D057.C | D002.A v47.19,73.3 D003.C | v74.07,32.72 D016.A | v73.91,27.48 D018.C | J406.4 40.84,19.76 44.32,19.76 R1.5
  Bottom 0.152: v46.43,70.31 v47.19,73.3 | v71.02,33.17 v74.07,32.72 | v70,28.65 v73.91,27.48 | v40.31,1.8 v40.13,4.88 39.37,5.64 J406.4 | v32.03,5.38 v31.29,1.37 | v4.83,37.24 v0.76,37.13 | v27,69.47 v25.63,73.3 | v63.3,59.82 66.19,62.31 D108.C | v69.52,27.13 73.13,25.88 D018.C | v47.7,6.25 48.79,2.59 D127.C | v20.83,9.65 18.85,6.4 D135.C | v6.25,28.5 2.59,27.41 D142.C | v6.68,49.07 3.07,50.32 D148.C | v16.38,63.3 13.89,66.19 D153.C
Q05  (via drill 0.33)
  Top 0.152: v49.48,68.56 50.55,68.15 51.33,67.79 51.97,67.51 52.6,67.21 53.62,66.67 54.36,66.27 54.97,65.89 55.58,65.53 56.52,64.9 57.2,64.41 57.78,63.98 58.34,63.55 59.21,62.81 59.84,62.26 60.38,61.77 60.88,61.29 61.67,60.48 62.26,59.84 62.74,59.33 63.2,58.78 63.88,57.89 64.41,57.2 v64.82,56.64 65.2,56.03 65.81,55.09 66.27,54.36 66.6,53.75 66.93,53.11 67.44,52.09 67.79,51.33 68.35,50.01 68.76,48.95 69.01,48.16 69.24,47.47 69.42,46.79 69.72,45.7 69.9,44.86 70.05,44.17 70.16,43.46 70.33,42.34 70.43,41.5 70.51,40.79 70.56,40.08 70.61,38.96 70.61,37.39 70.59,36.68 70.51,35.56 70.43,34.7 70.36,33.98 70.26,33.3 70.08,32.18 69.9,31.34 69.75,30.66 v69.57,29.97 69.27,28.85 69.01,28.04 68.56,26.72 v68.15,25.65 67.79,24.87 v67.51,24.23 67.21,23.6 66.67,22.58 66.27,21.84 65.89,21.23 65.53,20.62 64.9,19.68 64.41,19 63.98,18.41 63.55,17.86 62.81,16.99 62.26,16.36 61.77,15.82 61.29,15.32 60.48,14.53 59.84,13.95 59.33,13.46 58.78,13.01 57.89,12.32 57.2,11.79 56.64,11.38 56.03,11 55.09,10.39 54.36,9.93 53.75,9.6 53.11,9.27 52.09,8.76 51.33,8.41 50.01,7.85 48.95,7.44 48.16,7.19 47.47,6.96 46.79,6.78 45.7,6.48 44.86,6.3 v44.17,6.15 43.46,6.04 42.34,5.87 41.5,5.77 40.79,5.69 40.08,5.64 38.96,5.59 37.39,5.59 v36.68,5.61 35.56,5.69 34.7,5.77 33.98,5.84 33.3,5.94 32.18,6.12 31.34,6.3 30.66,6.45 29.97,6.63 v28.85,6.93 28.04,7.19 26.72,7.64 25.65,8.05 24.87,8.41 24.23,8.69 23.6,8.99 22.58,9.53 21.84,9.93 21.23,10.31 20.62,10.67 19.68,11.3 19,11.79 v18.41,12.22 17.86,12.65 16.99,13.39 16.36,13.95 15.82,14.43 15.32,14.91 14.53,15.72 13.95,16.36 13.46,16.87 13.01,17.42 12.32,18.31 11.79,19 11.38,19.56 11,20.17 10.39,21.11 9.93,21.84 9.6,22.45 9.27,23.09 8.76,24.11 8.41,24.87 7.85,26.19 7.44,27.25 7.19,28.04 6.96,28.73 v6.78,29.41 6.48,30.5 6.3,31.34 v6.15,32.03 6.04,32.74 5.87,33.86 5.77,34.7 5.69,35.41 5.64,36.12 5.59,37.24 5.59,38.81 5.61,39.52 v5.69,40.64 5.77,41.5 5.84,42.22 5.94,42.9 6.12,44.02 6.3,44.86 6.45,45.54 6.63,46.23 6.93,47.35 7.19,48.16 7.64,49.48 8.05,50.55 8.41,51.33 v8.69,51.97 8.99,52.6 9.53,53.62 9.93,54.36 10.31,54.97 10.67,55.58 11.3,56.52 11.79,57.2 12.22,57.78 12.65,58.34 13.39,59.21 13.95,59.84 14.43,60.38 14.91,60.88 15.72,61.67 16.36,62.26 16.87,62.74 17.42,63.2 18.31,63.88 19,64.41 19.56,64.82 20.17,65.2 21.11,65.81 21.84,66.27 22.45,66.6 23.09,66.93 24.11,67.44 24.87,67.79 26.19,68.35 27.25,68.76 28.04,69.01 28.73,69.24 29.41,69.42 v30.5,69.72
  Top 0.152: v29.39,74.42 D058.C | v36.52,1.78 D030.A | v27.48,2.29 D033.C | v3.07,28.4 D042.A | v0.86,41.02 D046.C | D003.A v50.83,72.16 D004.C | v73.3,29.01 D017.A | v72.59,23.8 D019.C | J406.5 35.33,19.79 31.85,19.79 R2.8
  Bottom 0.152: v49.48,68.56 v50.83,72.16 | v69.57,29.97 v73.3,29.01 | v68.15,25.65 v72.59,23.8 | v36.52,1.78 v36.68,5.61 36.68,18.14 J406.5 | v28.85,6.93 v27.48,2.29 | v6.78,29.41 v3.07,28.4 | v5.69,40.64 v0.86,41.02 | v30.5,69.72 v29.39,74.42 | v64.82,56.64 68.58,59.23 D109.C | v67.51,24.23 71.65,22.28 D019.C | v44.17,6.15 45.01,1.65 D128.C | v18.41,12.22 15.65,8.59 D136.C | v6.15,32.03 1.65,31.19 D143.C | v8.69,51.97 4.55,53.92 D149.C
Q06  (via drill 0.33)
  Top 0.152: v52.27,66.52 53.24,66.02 53.98,65.61 54.56,65.25 55.17,64.87 56.08,64.26 56.77,63.78 57.33,63.37 57.86,62.94 58.73,62.26 59.33,61.7 59.84,61.21 60.35,60.76 61.14,59.94 61.7,59.33 62.15,58.83 62.61,58.29 63.3,57.43 63.78,56.77 64.19,56.19 64.57,55.63 65.18,54.69 65.61,53.98 v65.94,53.37 66.27,52.76 66.75,51.77 67.11,51 67.39,50.37 67.64,49.73 68.02,48.69 68.3,47.9 68.71,46.58 68.96,45.52 69.16,44.7 69.42,43.33 69.57,42.24 69.67,41.43 69.75,40.74 69.8,40.03 69.85,38.94 69.85,37.41 69.83,36.7 69.75,35.61 69.67,34.77 69.6,34.09 69.49,33.4 69.32,32.31 69.16,31.5 69.01,30.81 68.83,30.15 68.56,29.08 68.3,28.3 v67.84,26.98 67.44,25.96 67.11,25.2 66.83,24.56 66.52,23.93 v66.02,22.96 65.61,22.23 v65.25,21.64 64.87,21.03 64.26,20.12 63.78,19.43 63.37,18.87 62.94,18.34 62.26,17.48 61.7,16.87 61.21,16.36 60.76,15.85 59.94,15.06 59.33,14.5 58.83,14.05 58.29,13.59 57.43,12.9 56.77,12.42 56.19,12.01 55.63,11.63 54.69,11.02 53.98,10.59 52.76,9.93 51.77,9.45 51,9.09 50.37,8.81 49.73,8.56 48.69,8.18 47.9,7.9 46.58,7.49 45.52,7.24 44.7,7.04 43.33,6.78 42.24,6.63 41.43,6.53 v40.74,6.45 40.03,6.4 38.94,6.35 37.41,6.35 36.7,6.38 35.61,6.45 34.77,6.53 34.09,6.6 v33.4,6.71 32.31,6.88 31.5,7.04 30.81,7.19 30.15,7.37 29.08,7.64 28.3,7.9 26.98,8.36 v25.96,8.76 25.2,9.09 24.56,9.37 23.93,9.68 22.96,10.19 22.23,10.59 21.64,10.95 21.03,11.33 20.12,11.94 19.43,12.42 18.87,12.83 18.34,13.26 17.48,13.95 16.87,14.5 v16.36,14.99 15.85,15.44 15.06,16.26 14.5,16.87 14.05,17.37 13.59,17.91 12.9,18.77 12.42,19.43 12.01,20.02 11.63,20.57 11.02,21.51 10.59,22.23 9.93,23.44 9.45,24.43 9.09,25.2 8.81,25.83 8.56,26.47 8.18,27.51 7.9,28.3 7.49,29.62 7.24,30.68 7.04,31.5 v6.78,32.87 6.63,33.96 6.53,34.77 v6.45,35.46 6.4,36.17 6.35,37.26 6.35,38.79 6.38,39.5 6.45,40.59 6.53,41.43 6.6,42.11 6.71,42.8 v6.88,43.89 7.04,44.7 7.19,45.39 7.37,46.05 7.64,47.12 7.9,47.9 8.36,49.23 8.76,50.24 9.09,51 9.37,51.64 9.68,52.27 10.19,53.24 10.59,53.98 10.95,54.56 11.33,55.17 11.94,56.08 12.42,56.77 12.83,57.33 13.26,57.86 13.95,58.73 14.5,59.33 14.99,59.84 15.44,60.35 16.26,61.14 16.87,61.7 17.37,62.15 17.91,62.61 18.77,63.3 19.43,63.78 20.02,64.19 v20.57,64.57 21.51,65.18 22.23,65.61 23.44,66.27 24.43,66.75 25.2,67.11 25.83,67.39 26.47,67.64 27.51,68.02 28.3,68.3 29.62,68.71 30.68,68.96 31.5,69.16 32.87,69.42 v33.96,69.57
  Top 0.152: v33.22,75.13 D059.C | D004.A v54.33,70.64 D005.C | v32.72,2.13 D031.A | v23.8,3.61 D034.C | v2.23,32.11 D043.A | v1.37,44.91 D047.C | v18.03,68.43 D054.A | v72.16,25.38 D018.A | 70.81,19.21 D020.C v70.92,20.27 | J406.6 33.1,19.48 30.48,19.48 R2.7
  Bottom 0.152: v52.27,66.52 v54.33,70.64 | v67.84,26.98 v72.16,25.38 | v66.02,22.96 v70.92,20.27 | v32.72,2.13 v33.4,6.71 33.4,17.4 J406.6 | v25.96,8.76 v23.8,3.61 | v6.78,32.87 v2.23,32.11 | v6.88,43.89 v1.37,44.91 | v20.57,64.57 v18.03,68.43 | v33.96,69.57 v33.22,75.13 | v65.94,53.37 70.61,55.93 D110.C | v65.25,21.64 69.8,18.85 D020.C | v40.74,6.45 41.17,1.14 D129.C | v16.36,14.99 12.68,11.07 D137.C | v6.45,35.46 1.14,35.03 D144.C
Q07  (via drill 0.33)
  Top 0.152: v38.79,69.09 39.45,69.06 40.54,68.99 41.35,68.91 42.67,68.76 43.74,68.58 44.55,68.4 45.21,68.28 45.85,68.1 46.89,67.82 47.68,67.56 48.31,67.36 48.95,67.13 49.96,66.73 50.7,66.42 51.31,66.12 51.92,65.84 52.88,65.33 53.59,64.95 v54.76,64.24 55.65,63.63 56.31,63.17 57.38,62.36 58.22,61.67 58.83,61.14 59.33,60.68 60.58,59.44 61.14,58.83 62,57.81 62.69,56.97 63.17,56.31 63.93,55.19 64.52,54.28 64.95,53.59 65.28,53.01 66.06,51.44 66.42,50.7 v66.67,50.09 66.93,49.45 67.31,48.44 67.56,47.68 67.77,47.04 67.97,46.38 68.22,45.34 68.4,44.55 68.56,43.89 68.66,43.2 68.83,42.14 68.91,41.35 68.99,40.66 69.04,39.98 69.09,38.91 69.09,37.41 69.06,36.75 68.99,35.66 68.91,34.85 68.76,33.53 68.58,32.46 68.4,31.65 68.28,30.99 68.1,30.35 67.82,29.31 67.56,28.52 67.36,27.89 67.13,27.25 66.73,26.24 66.42,25.5 66.12,24.89 v65.84,24.28 65.33,23.32 64.95,22.61 64.24,21.44 v63.63,20.55 63.17,19.89 v62.76,19.36 62.36,18.82 61.67,17.98 61.14,17.37 60.68,16.87 59.44,15.62 58.83,15.06 57.81,14.2 56.97,13.51 56.31,13.03 55.19,12.27 54.28,11.68 53.59,11.25 53.01,10.92 51.44,10.13 50.7,9.78 50.09,9.53 49.45,9.27 48.44,8.89 47.68,8.64 47.04,8.43 46.38,8.23 45.34,7.98 44.55,7.8 43.89,7.64 43.2,7.54 42.14,7.37 41.35,7.29 40.66,7.21 39.98,7.16 38.91,7.11 v37.41,7.11 36.75,7.14 35.66,7.21 34.85,7.29 33.53,7.44 32.46,7.62 31.65,7.8 30.99,7.92 v30.35,8.1 29.31,8.38 28.52,8.64 27.89,8.84 27.25,9.07 26.24,9.47 25.5,9.78 24.89,10.08 24.28,10.36 v23.32,10.87 22.61,11.25 21.44,11.96 20.55,12.57 19.89,13.03 18.82,13.84 17.98,14.53 17.37,15.06 16.87,15.52 15.62,16.76 15.06,17.37 v14.63,17.88 14.2,18.39 13.51,19.23 13.03,19.89 12.27,21.01 11.68,21.92 11.25,22.61 10.92,23.19 10.13,24.77 9.78,25.5 9.53,26.11 9.27,26.75 8.89,27.76 8.64,28.52 8.43,29.16 8.23,29.82 7.98,30.86 7.8,31.65 7.64,32.31 7.54,32.99 7.37,34.06 7.29,34.85 7.21,35.53 v7.16,36.22 7.11,37.29 7.11,38.79 7.14,39.45 7.21,40.54 7.29,41.35 7.44,42.67 7.62,43.74 7.8,44.55 7.92,45.21 8.1,45.85 v8.38,46.89 8.64,47.68 8.84,48.31 9.07,48.95 9.47,49.96 9.78,50.7 10.08,51.31 10.36,51.92 10.87,52.88 11.25,53.59 11.96,54.76 12.57,55.65 13.03,56.31 13.84,57.38 14.53,58.22 15.06,58.83 15.52,59.33 16.76,60.58 17.37,61.14 18.39,62 19.23,62.69 19.89,63.17 21.01,63.93 21.92,64.52 22.61,64.95 23.19,65.28 v23.8,65.58
  Top 0.152: D105.A v57.63,68.76 D006.C | v29.01,2.9 D032.A | v20.27,5.28 D035.C | v1.8,35.89 D044.A | v2.29,48.72 D048.C | v21.31,70.36 D055.A | v68.89,16.94 D021.C | v70.64,21.87 D019.A | J406.7 30.86,19.18 30,19.18 30,20.6 R2.6
  Bottom 0.152: v57.63,68.76 v54.76,64.24 53.59,64.95 55.91,68.94 D105.A | v65.84,24.28 v70.64,21.87 | v63.63,20.55 v68.89,16.94 | v29.01,2.9 v30.35,8.1 30.35,16.89 J406.7 | v23.32,10.87 v20.27,5.28 | v7.16,36.22 v1.8,35.89 | v8.38,46.89 v2.29,48.72 | v23.8,65.58 v21.31,70.36 | v38.79,69.09 38.91,75.18 D100.C | v66.67,50.09 72.31,52.45 D111.C | v62.76,19.36 67.61,15.65 D021.C | v37.41,7.11 37.29,1.02 D130.C | v14.63,17.88 10.01,13.89 D138.C
Q08  (via drill 0.33)
  Top 0.152: v41.91,68.07 42.57,68 43.61,67.82 44.37,67.67 45.03,67.51 45.67,67.36 46.69,67.08 47.45,66.85 48.06,66.62 48.69,66.42 49.66,66.02 50.39,65.71 51,65.43 51.59,65.15 52.53,64.67 53.21,64.29 53.77,63.93 54.33,63.6 55.22,63.02 55.85,62.56 v56.92,61.75 57.73,61.09 58.32,60.55 58.8,60.12 59.28,59.66 60.02,58.9 60.55,58.32 61.01,57.84 61.42,57.33 62.08,56.49 62.56,55.85 62.94,55.32 63.3,54.79 63.88,53.9 64.29,53.21 64.59,52.63 64.92,52.05 65.38,51.1 65.71,50.39 66.22,49.17 66.6,48.18 66.85,47.45 v67.06,46.81 67.23,46.18 67.49,45.16 67.67,44.37 67.79,43.74 67.92,43.08 68.07,42.04 68.15,41.25 68.22,40.62 68.28,39.95 68.33,38.89 v68.33,38.1 68.33,37.44 68.3,36.78 68.22,35.74 68.15,34.95 68,33.63 67.82,32.59 67.67,31.83 67.51,31.17 67.36,30.53 67.08,29.52 66.85,28.75 66.62,28.14 66.42,27.51 66.02,26.54 65.71,25.81 65.43,25.2 65.15,24.61 64.67,23.67 64.29,22.99 63.93,22.43 v63.6,21.87 63.02,20.98 62.56,20.34 61.75,19.28 v61.09,18.47 60.55,17.88 v60.12,17.4 59.66,16.92 58.9,16.18 58.32,15.65 57.84,15.19 57.33,14.78 56.49,14.12 55.85,13.64 55.32,13.26 54.79,12.9 53.9,12.32 53.21,11.91 52.63,11.61 52.05,11.28 51.1,10.82 50.39,10.49 49.17,9.98 48.18,9.6 47.45,9.35 46.81,9.14 46.18,8.97 45.16,8.71 44.37,8.53 43.74,8.41 43.08,8.28 42.04,8.13 41.25,8.05 40.62,7.98 39.95,7.92 38.89,7.87 37.44,7.87 36.78,7.9 35.74,7.98 34.95,8.05 v34.29,8.13 33.63,8.2 32.59,8.38 31.83,8.53 31.17,8.69 30.53,8.84 29.52,9.12 28.75,9.35 28.14,9.58 v27.51,9.78 26.54,10.19 25.81,10.49 25.2,10.77 24.61,11.05 23.67,11.53 22.99,11.91 22.43,12.27 21.87,12.6 v20.98,13.18 20.34,13.64 19.28,14.45 18.47,15.11 17.88,15.65 17.4,16.08 16.92,16.54 16.18,17.3 15.65,17.88 15.19,18.36 14.78,18.87 14.12,19.71 13.64,20.34 13.26,20.88 12.9,21.41 12.32,22.3 11.91,22.99 11.61,23.57 11.28,24.16 10.82,25.09 10.49,25.81 9.98,27.03 9.6,28.02 9.35,28.75 9.14,29.39 8.97,30.02 8.71,31.04 8.53,31.83 8.41,32.46 8.28,33.12 8.13,34.16 8.05,34.95 7.98,35.59 7.92,36.25 7.87,37.31 7.87,38.76 v7.9,39.42 7.98,40.46 8.05,41.25 8.2,42.57 8.38,43.61 8.53,44.37 8.69,45.03 8.84,45.67 9.12,46.69 9.35,47.45 9.58,48.06 9.78,48.69 v10.19,49.66 10.49,50.39 10.77,51 11.05,51.59 11.53,52.53 11.91,53.21 12.27,53.77 12.6,54.33 13.18,55.22 13.64,55.85 14.45,56.92 15.11,57.73 15.65,58.32 16.08,58.8 16.54,59.28 17.3,60.02 17.88,60.55 18.36,61.01 18.87,61.42 19.71,62.08 20.34,62.56 20.88,62.94 21.41,63.3 22.3,63.88 22.99,64.29 23.57,64.59 24.16,64.92 25.09,65.38 25.81,65.71 v27.03,66.22
  Top 0.152: v25.38,4.04 D033.A | D036.C v16.94,7.32 | v1.78,39.67 D045.A | v3.61,52.4 D049.C | v24.77,71.93 D056.A | D007.C v60.73,66.55 59.48,67.53 D106.A | v66.5,13.84 D022.C | v68.76,18.57 D020.A | J406.8 29.41,18.29 29.41,20.6 R2.5
  Bottom 0.152: v63.6,21.87 v68.76,18.57 | v61.09,18.47 v66.5,13.84 | v25.38,4.04 v27.51,9.78 27.51,12.01 27.94,12.45 27.94,17.02 J406.8 | v16.94,7.32 v20.98,13.18 | v7.9,39.42 v1.78,39.67 | v10.19,49.66 v3.61,52.4 | v27.03,66.22 v24.77,71.93 | v41.91,68.07 42.77,74.91 D101.C | v67.06,46.81 73.61,48.79 D112.C | v60.12,17.4 65.13,12.68 D022.C | v34.29,8.13 33.43,1.29 D131.C | D106.A 59.03,66.9 55.85,62.56 v56.92,61.75 v60.73,66.55 | v68.33,38.1 D115.A
Q09  (via drill 0.33)
  Top 0.152: v44.86,66.78 45.47,66.62 46.46,66.34 47.19,66.12 48.41,65.71 49.38,65.33 50.09,65.02 51.26,64.47 52.17,63.98 52.83,63.63 53.39,63.3 53.92,62.94 54.79,62.38 55.42,61.92 56.44,61.16 57.23,60.5 57.81,59.99 58.29,59.56 v58.75,59.11 59.46,58.37 59.99,57.81 60.43,57.33 60.83,56.84 61.47,56.03 61.92,55.42 62.31,54.89 62.66,54.36 63.22,53.49 63.63,52.83 64.24,51.71 64.69,50.77 65.02,50.09 65.28,49.51 65.51,48.9 65.86,47.93 66.12,47.19 66.32,46.58 66.5,45.97 66.75,44.98 66.93,44.22 v67.06,43.59 67.16,42.95 67.31,41.94 67.41,41.17 67.51,39.9 67.56,38.86 67.56,37.47 67.54,36.8 67.46,35.79 v67.41,35.03 67.33,34.39 67.23,33.76 67.08,32.74 66.93,31.98 66.78,31.34 66.62,30.73 66.34,29.74 66.12,29.01 65.71,27.79 65.33,26.82 65.02,26.11 64.47,24.94 63.98,24.03 63.63,23.37 63.3,22.81 62.94,22.28 62.38,21.41 61.92,20.78 v61.16,19.76 60.5,18.97 59.99,18.39 59.56,17.91 59.11,17.45 v58.37,16.74 57.81,16.2 v57.33,15.77 56.84,15.37 56.03,14.73 v55.42,14.28 54.89,13.89 54.36,13.54 53.49,12.98 52.83,12.57 51.71,11.96 50.77,11.51 50.09,11.18 49.51,10.92 48.9,10.69 47.93,10.34 47.19,10.08 46.58,9.88 45.97,9.7 44.98,9.45 44.22,9.27 43.59,9.14 42.95,9.04 41.94,8.89 41.17,8.79 39.9,8.69 38.86,8.64 37.47,8.64 36.8,8.66 35.79,8.74 35.03,8.79 34.39,8.87 33.76,8.97 32.74,9.12 31.98,9.27 31.34,9.42 30.73,9.58 29.74,9.86 29.01,10.08 27.79,10.49 26.82,10.87 26.11,11.18 v24.94,11.73 24.03,12.22 23.37,12.57 22.81,12.9 22.28,13.26 21.41,13.82 20.78,14.28 19.76,15.04 v18.97,15.7 18.39,16.2 17.91,16.64 17.45,17.09 16.74,17.83 16.2,18.39 15.77,18.87 15.37,19.36 14.73,20.17 14.28,20.78 13.89,21.31 13.54,21.84 12.98,22.71 12.57,23.37 11.96,24.49 11.51,25.43 11.18,26.11 10.92,26.7 10.69,27.3 10.34,28.27 10.08,29.01 9.88,29.62 9.7,30.23 9.45,31.22 9.27,31.98 9.14,32.61 9.04,33.25 8.89,34.27 8.79,35.03 8.69,36.3 8.64,37.34 8.64,38.73 8.66,39.4 8.74,40.41 8.79,41.17 8.87,41.81 v8.97,42.44 9.12,43.46 9.27,44.22 9.42,44.86 9.58,45.47 9.86,46.46 10.08,47.19 10.49,48.41 10.87,49.38 11.18,50.09 11.73,51.26 v12.22,52.17 12.57,52.83 12.9,53.39 13.26,53.92 13.82,54.79 14.28,55.42 15.04,56.44 15.7,57.23 16.2,57.81 16.64,58.29 17.09,58.75 17.83,59.46 18.39,59.99 18.87,60.43 19.36,60.83 20.17,61.47 20.78,61.92 21.31,62.31 21.84,62.66 22.71,63.22 23.37,63.63 24.49,64.24 25.43,64.69 26.11,65.02 26.7,65.28 27.3,65.51 28.27,65.86 29.01,66.12 29.62,66.32 v30.23,66.5
  Top 0.152: v21.87,5.56 D034.A | D037.C v13.84,9.7 | v2.13,43.48 D046.A | v5.28,55.93 D050.C | v28.4,73.13 D057.A | D008.C v63.58,64.03 62.45,65.14 D107.A | v63.8,11.02 D023.C | v66.55,15.47 D021.A | J405.1 28.93,57.91 28.93,55.09 R3.8
  Bottom 0.152: v61.16,19.76 v66.55,15.47 | v58.37,16.74 v63.8,11.02 | v24.94,11.73 v21.87,5.56 | v13.84,9.7 v18.97,15.7 | v8.97,42.44 v2.13,43.48 | v12.22,52.17 v5.28,55.93 | v28.4,73.13 v30.23,66.5 31.24,65.48 31.24,59.94 J405.1 | v44.86,66.78 46.61,74.19 D102.C | v67.06,43.59 74.55,45.01 D113.C | v67.41,35.03 73.51,34.39 D116.A | v57.33,15.77 62.31,10.01 D023.C | v55.42,14.28 59.03,9.3 D124.A | D107.A 61.92,64.54 57.81,59.99 v58.75,59.11 v63.58,64.03
Q10  (via drill 0.33)
  Top 0.152: v47.57,65.2 48.16,64.97 49.07,64.62 49.78,64.31 50.34,64.06 50.9,63.78 51.79,63.32 52.45,62.97 53.52,62.31 54.36,61.75 54.97,61.32 55.47,60.94 55.96,60.55 56.74,59.92 57.3,59.44 58.22,58.57 58.93,57.86 59.44,57.3 59.84,56.84 v60.25,56.36 60.86,55.58 61.32,54.97 62.03,53.95 62.56,53.09 62.97,52.45 63.27,51.92 64.01,50.44 64.31,49.78 64.57,49.2 64.8,48.62 65.15,47.68 65.41,46.97 65.58,46.38 65.76,45.77 66.02,44.81 66.17,44.07 66.42,42.85 66.55,41.83 66.65,41.1 v66.7,40.49 66.75,39.85 66.8,38.86 66.8,37.47 66.78,36.85 66.73,35.84 66.65,35.1 66.57,34.47 66.5,33.86 66.32,32.87 v66.17,32.13 66.04,31.52 65.89,30.91 65.61,29.95 65.41,29.23 65.2,28.63 64.97,28.04 64.62,27.13 64.31,26.42 64.06,25.86 63.78,25.3 63.32,24.41 62.97,23.75 62.31,22.68 61.75,21.84 61.32,21.23 60.94,20.73 60.55,20.24 59.92,19.46 59.44,18.9 v58.57,17.98 57.86,17.27 57.3,16.76 56.84,16.36 56.36,15.95 v55.58,15.34 54.97,14.88 53.95,14.17 53.09,13.64 v52.45,13.23 51.92,12.93 50.44,12.19 49.78,11.89 49.2,11.63 48.62,11.4 47.68,11.05 46.97,10.79 46.38,10.62 45.77,10.44 44.81,10.19 44.07,10.03 42.85,9.78 41.83,9.65 41.1,9.55 40.49,9.5 39.85,9.45 38.86,9.4 37.47,9.4 36.85,9.42 35.84,9.47 35.1,9.55 34.47,9.63 33.86,9.7 32.87,9.88 v32.13,10.03 31.52,10.16 30.91,10.31 29.95,10.59 29.23,10.79 28.63,11 28.04,11.23 27.13,11.58 26.42,11.89 25.86,12.14 25.3,12.42 24.41,12.88 23.75,13.23 v22.68,13.89 21.84,14.45 21.23,14.88 20.73,15.27 20.24,15.65 19.46,16.28 18.9,16.76 17.98,17.63 v17.27,18.34 16.76,18.9 16.36,19.36 15.95,19.84 15.34,20.62 14.88,21.23 14.17,22.25 13.64,23.11 13.23,23.75 12.93,24.28 12.19,25.76 11.89,26.42 11.63,27 11.4,27.58 11.05,28.52 10.79,29.23 10.62,29.82 10.44,30.43 10.19,31.39 10.03,32.13 9.78,33.35 9.65,34.37 9.55,35.1 9.5,35.71 9.45,36.35 9.4,37.34 9.4,38.73 9.42,39.34 9.47,40.36 9.55,41.1 9.63,41.73 9.7,42.34 9.88,43.33 10.03,44.07 10.16,44.68 v10.31,45.29 10.59,46.25 10.79,46.97 11,47.57 11.23,48.16 11.58,49.07 11.89,49.78 12.14,50.34 12.42,50.9 12.88,51.79 13.23,52.45 13.89,53.52 v14.45,54.36 14.88,54.97 15.27,55.47 15.65,55.96 16.28,56.74 16.76,57.3 17.63,58.22 18.34,58.93 18.9,59.44 19.36,59.84 19.84,60.25 20.62,60.86 21.23,61.32 22.25,62.03 23.11,62.56 23.75,62.97 24.28,63.27 25.76,64.01 26.42,64.31 27,64.57 27.58,64.8 28.52,65.15 29.23,65.41 29.82,65.58 30.43,65.76 31.39,66.02 32.13,66.17 v33.35,66.42
  Top 0.152: v32.11,73.97 D058.A | v18.57,7.44 D035.A | D038.C v11.02,12.39 | v2.9,47.19 D047.A | v7.32,59.26 D051.C | D009.C v66.14,61.21 65.14,62.45 D108.A | v60.83,8.48 D024.C | v64.03,12.62 D022.A | J405.2 30.58,56.74 29.49,56.74 29.49,55.09 R3.7
  Bottom 0.152: v58.57,17.98 v64.03,12.62 | v55.58,15.34 v60.83,8.48 | v22.68,13.89 v18.57,7.44 | v11.02,12.39 v17.27,18.34 | v10.31,45.29 v2.9,47.19 | v14.45,54.36 v7.32,59.26 | v32.11,73.97 v33.35,66.42 34.04,65.73 34.04,60.2 J405.2 | v47.57,65.2 50.32,73.13 D103.C | v66.7,40.49 75.06,41.17 D114.C | v66.17,32.13 72.92,30.71 D117.A | v52.45,13.23 55.91,7.26 D125.A | v32.13,10.03 30.71,3.28 D132.A | D108.A 64.54,61.92 59.44,57.3 v60.25,56.36 v66.14,61.21
Q11  (via drill 0.33)
  Top 0.152: v50.01,63.37 51.44,62.66 52.07,62.31 52.6,61.98 53.11,61.67 53.92,61.14 54.53,60.71 55.02,60.35 55.5,59.97 56.24,59.33 56.79,58.85 57.25,58.45 57.68,58.04 58.37,57.33 58.85,56.79 59.66,55.88 60.27,55.12 60.71,54.53 61.06,54.03 v61.39,53.52 61.92,52.7 62.31,52.07 62.59,51.54 62.89,51 63.32,50.14 63.63,49.45 64.08,48.34 64.44,47.42 64.67,46.74 65.02,45.57 65.28,44.63 65.43,43.92 65.56,43.31 65.66,42.72 65.81,41.76 65.89,41.02 65.99,39.8 66.04,38.84 66.04,37.49 66.02,36.88 65.96,35.92 65.89,35.18 65.73,33.96 65.58,33.02 65.43,32.28 65.3,31.7 65.15,31.11 64.9,30.18 v64.67,29.46 64.47,28.88 64.26,28.32 63.91,27.41 63.63,26.75 63.37,26.19 62.66,24.77 62.31,24.13 61.98,23.6 61.67,23.09 61.14,22.28 60.71,21.67 60.35,21.18 59.97,20.7 59.33,19.96 58.85,19.41 58.45,18.95 58.04,18.52 57.33,17.83 56.79,17.35 v55.88,16.54 55.12,15.93 54.53,15.49 54.03,15.14 53.52,14.81 v52.7,14.28 52.07,13.89 51.54,13.61 51,13.31 50.14,12.88 v49.45,12.57 48.34,12.12 47.42,11.76 46.74,11.53 45.57,11.18 44.63,10.92 43.92,10.77 43.31,10.64 42.72,10.54 41.76,10.39 41.02,10.31 39.8,10.21 38.84,10.16 37.49,10.16 36.88,10.19 35.92,10.24 35.18,10.31 33.96,10.46 33.02,10.62 32.28,10.77 31.7,10.9 31.11,11.05 30.18,11.3 v29.46,11.53 28.88,11.73 28.32,11.94 27.41,12.29 26.75,12.57 26.19,12.83 24.77,13.54 24.13,13.89 23.6,14.22 23.09,14.53 22.28,15.06 21.67,15.49 21.18,15.85 v20.7,16.23 19.96,16.87 19.41,17.35 18.95,17.75 18.52,18.16 17.83,18.87 17.35,19.41 16.54,20.32 v15.93,21.08 15.49,21.67 15.14,22.17 14.81,22.68 14.28,23.5 13.89,24.13 13.61,24.66 13.31,25.2 12.88,26.06 12.57,26.75 12.12,27.86 11.76,28.78 11.53,29.46 11.18,30.63 10.92,31.57 10.77,32.28 10.64,32.89 10.54,33.48 10.39,34.44 10.31,35.18 10.21,36.4 10.16,37.36 10.16,38.71 10.19,39.32 10.24,40.28 10.31,41.02 10.46,42.24 10.62,43.18 10.77,43.92 10.9,44.5 11.05,45.09 11.3,46.02 11.53,46.74 11.73,47.32 v11.94,47.88 12.29,48.79 12.57,49.45 12.83,50.01 13.54,51.44 13.89,52.07 14.22,52.6 14.53,53.11 15.06,53.92 15.49,54.53 15.85,55.02 16.23,55.5 v16.87,56.24 17.35,56.79 17.75,57.25 18.16,57.68 18.87,58.37 19.41,58.85 20.32,59.66 21.08,60.27 21.67,60.71 22.17,61.06 22.68,61.39 23.5,61.92 24.13,62.31 24.66,62.59 25.2,62.89 26.06,63.32 26.75,63.63 27.86,64.08 28.78,64.44 29.46,64.67 30.63,65.02 31.57,65.28 32.28,65.43 32.89,65.56 33.48,65.66 34.44,65.81 35.18,65.89 36.4,65.99
  Top 0.152: D059.A 35.89,74.4 36.4,65.99 | v15.47,9.65 D036.A | D039.C v8.48,15.37 | v4.04,50.83 D048.A | v9.7,62.36 D052.C | D010.C v68.43,58.17 67.53,59.48 D109.A | v57.61,6.25 D025.C | v61.21,10.06 D023.A | 36.4,65.99 36.4,60.02 J405.3 33.12,56.74 31.75,56.74 31.45,56.44 29.97,56.44 R3.6
  Bottom 0.152: v55.88,16.54 v61.21,10.06 | v52.7,14.28 v57.61,6.25 | v20.7,16.23 v15.47,9.65 | v8.48,15.37 v15.93,21.08 15.49,21.67 9.3,17.17 D139.A | v11.94,47.88 v4.04,50.83 | v16.87,56.24 v9.7,62.36 | v50.01,63.37 53.92,71.65 D104.C | v64.67,29.46 71.96,27.1 D118.A | v49.45,12.57 52.58,5.59 D126.A | v29.46,11.53 27.1,4.24 D133.A | D109.A 66.9,59.03 60.71,54.53 v61.39,53.52 v68.43,58.17
Q12  (via drill 0.33)